# Altium schematic sheet FABLAB_BOT_00.SchDoc: ESP12_DEV
size A3; Date: 18/08/2015; DrawnBy: Wim Van Gool; Revision: 00; SheetNumber: 1; SheetTotal: 1; PageSetup: Record=PageOptions|CenterHorizontal=True|CenterVertical=True|PrintScale=0.70|XCorrection=1.00|YCorrection=1.00|PrintKind=1|BorderSize=5000000|LeftOffset=0|BottomOffset=0|Orientation=2|PaperLength=1000|PaperWidth=1000|Scale=100|PaperSource=15|PrintQuality=600|MediaType=1|DitherType=10|PrintScaleMode=1|PaperKind=A4 (210 x 297 mm)|PaperIndex=9
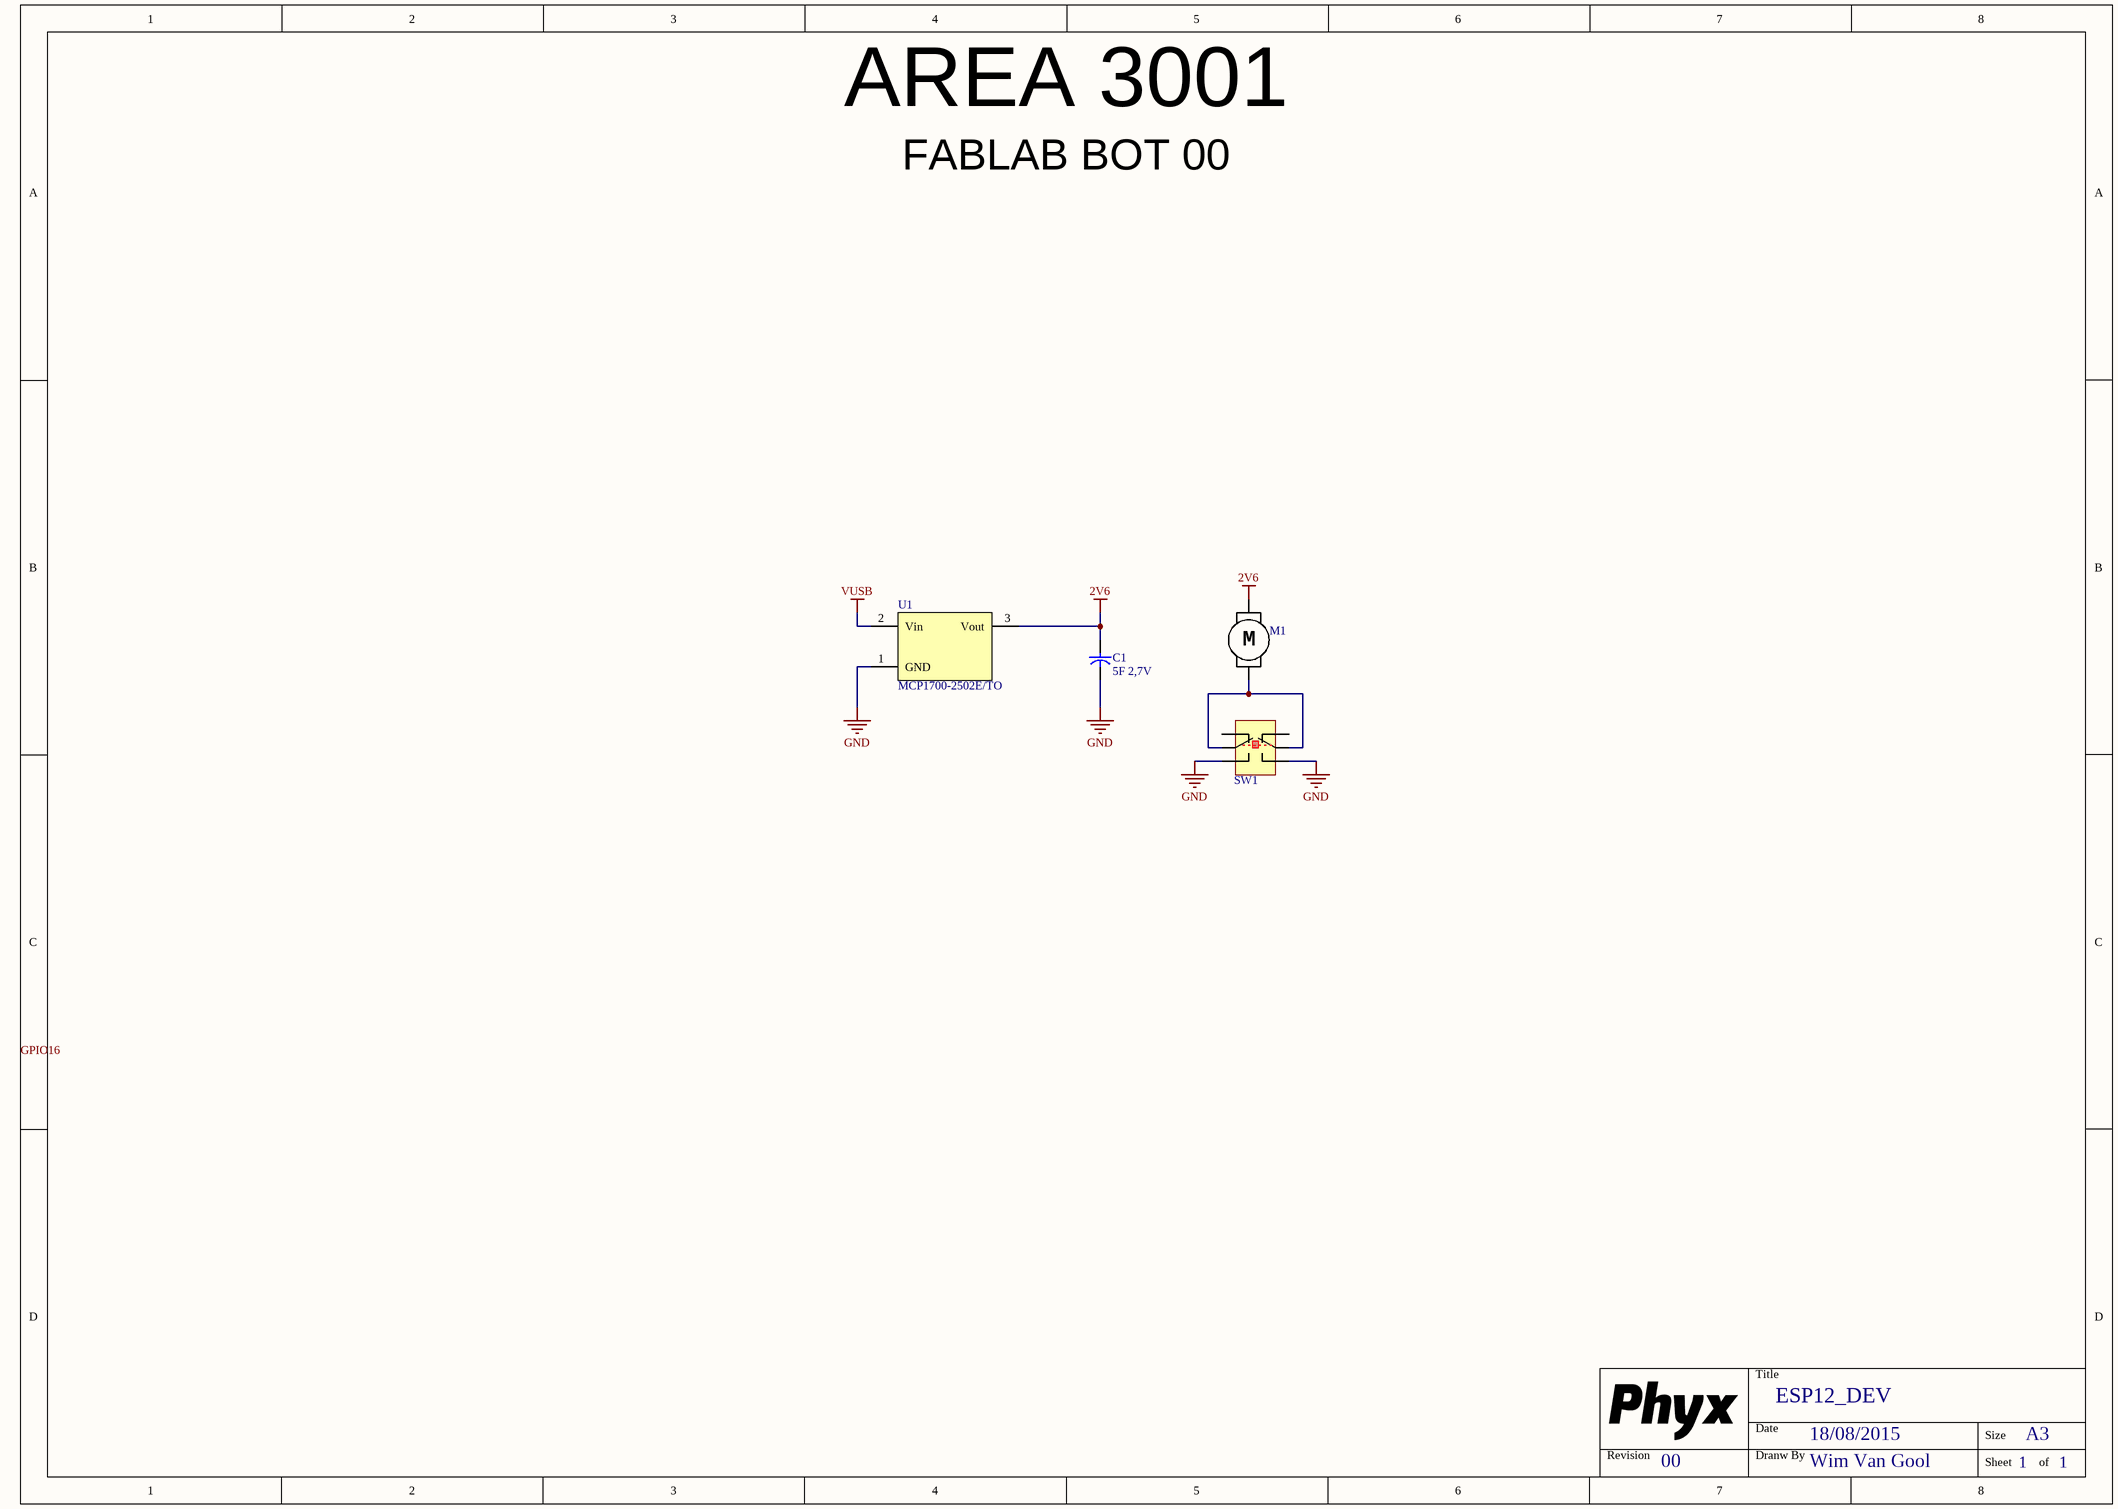
[diagram p0: FABLAB_BOT_00.SchDoc]

## Parts
C1  value 5F 2,7V  [C_10x20mm]  (hidden comment: CAP_POL)
M1  Vibration Motor 3,9 x 8,5mm  [VBR_3.9x8.5]  (value not drawn)
SW1  mini Switch 2 pole double throw  [MCLSS22P]  (value not drawn)
U1  value MCP1700-2502E/TO  [TO-92A]  (hidden comment: 2,5V LDO)

## Nets
2V6: C1.1 M1.1 U1.3(Vout)
GND: C1.2 SW1.5 SW1.6 U1.1(GND)
VUSB: U1.2(Vin)
NetM1_2: M1.2 SW1.3 SW1.4

Not connected (* = marked no-connect by the designer): SW1 1 2

## Notes on the sheet
- AREA 3001
- FABLAB BOT 00
- Title
- Revision
- Date
- Dranw By
- Size
- A3
- Sheet
- of
- Labels drawn without touching a wire or pin: GPIO16
- (in symbol Vibration Motor 3.9x8.5) M

## Library data of the parts
C1 = CAP 2V7 5F 10mm: Capacitor electrolyt; Supplier 1: Aliexpress
M1 = Vibration Motor 3.9x8.5: =Description; Value: Vibration Motor 3.9x8.5
SW1 = SW 2P2T micro: Value: MCLSS22P; Supplier 1: Farnell
U1 = LDO 2V5 TO-92 MCP1700-25: =Designator; Supplier 1: Farnell